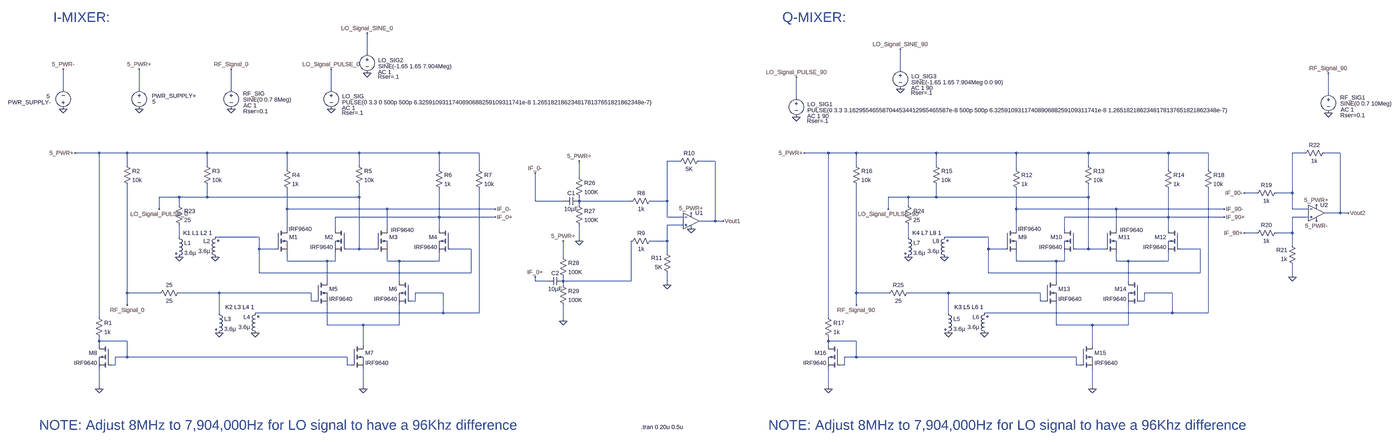
[diagram p0: schematic QUADRATURE MIXERS (MARCH 08,2025) biased outputs.asc, whole sheet]
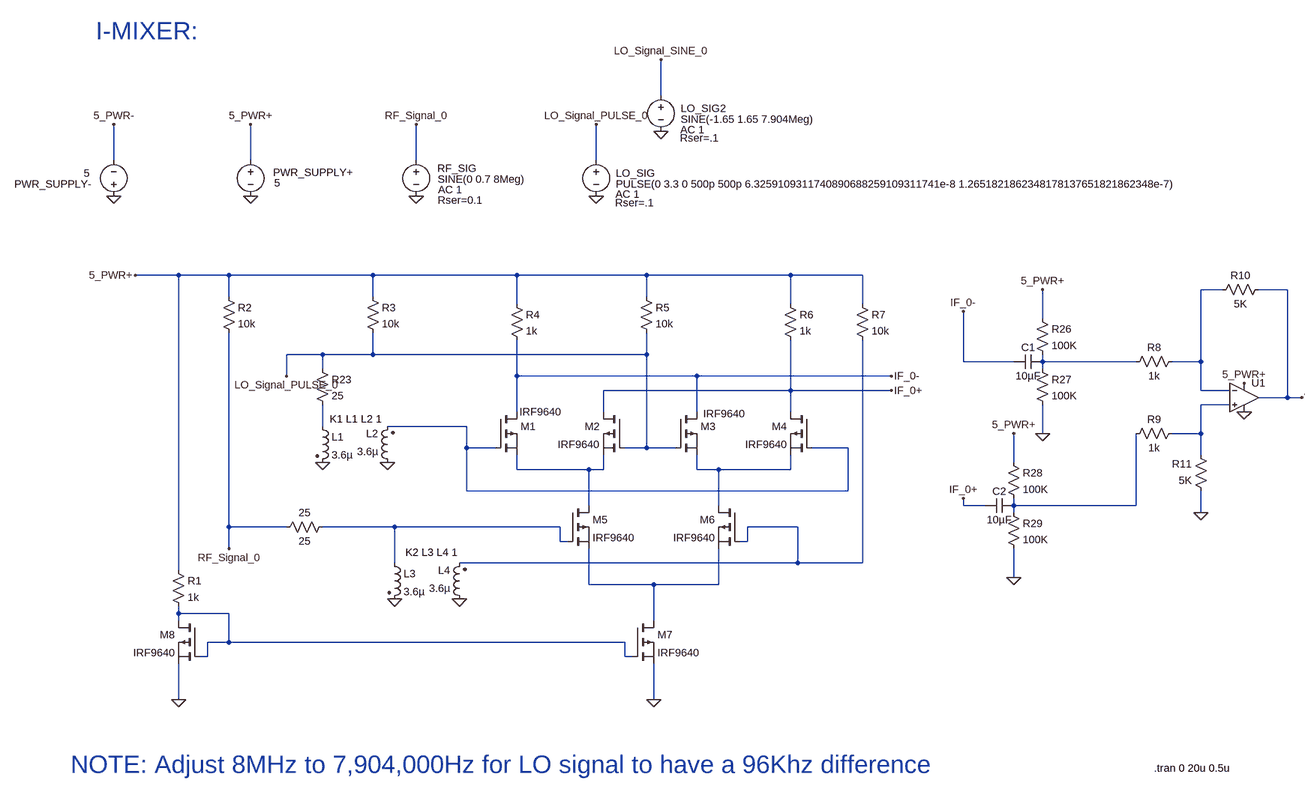
[diagram p1: schematic QUADRATURE MIXERS (MARCH 08,2025) biased outputs.asc, part, row 1 of 1, column 1 of 2]
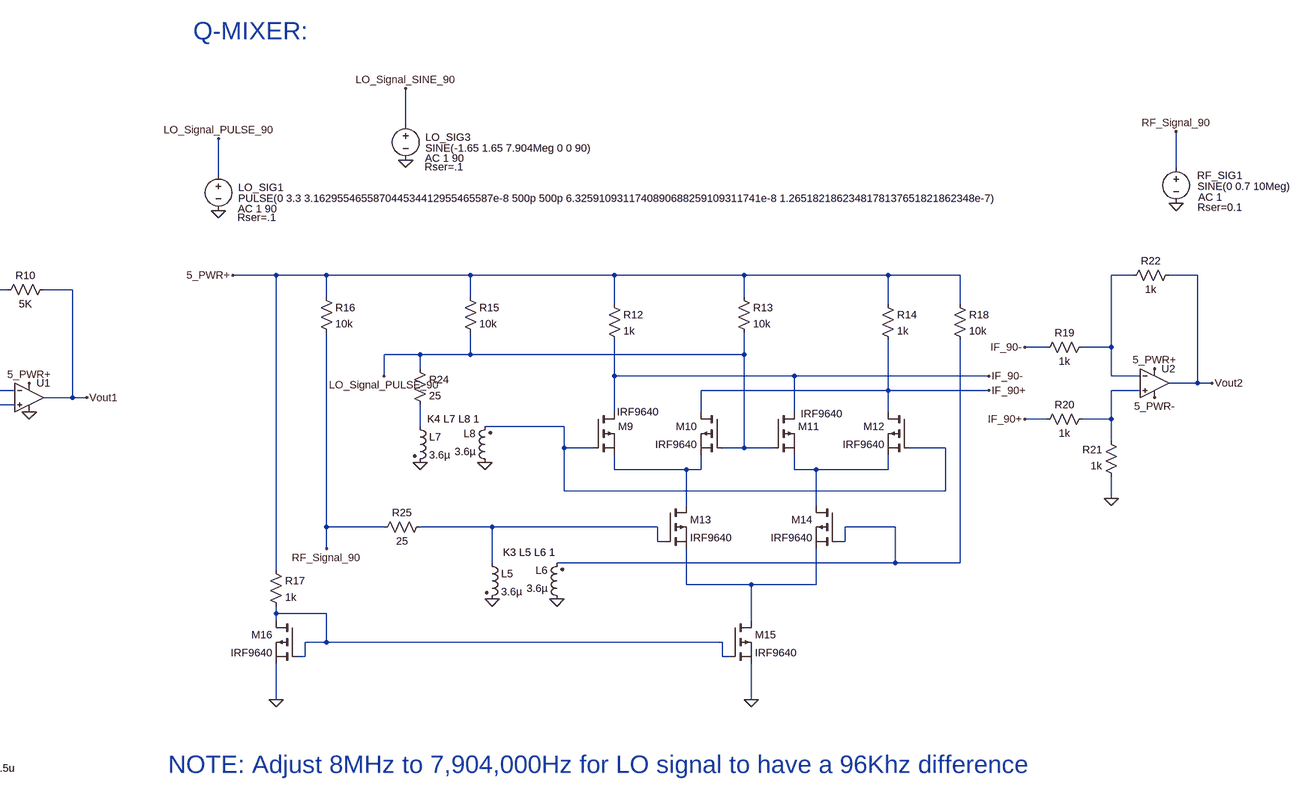
[diagram p2: schematic QUADRATURE MIXERS (MARCH 08,2025) biased outputs.asc, part, row 1 of 1, column 2 of 2]
QUADRATURE MIXERS (MARCH 08,2025) biased outputs.asc, the LTspice schematic file:
Version 4
SHEET 1 5048 2228
WIRE 352 464 352 384
WIRE 2528 528 2528 448
WIRE -864 608 -864 528
WIRE -560 608 -560 528
WIRE -192 608 -192 528
WIRE 208 608 208 528
WIRE 4240 624 4240 544
WIRE 2112 640 2112 560
WIRE -720 864 -816 864
WIRE -608 864 -720 864
WIRE -288 864 -608 864
WIRE 32 864 -288 864
WIRE 320 864 32 864
WIRE 640 864 320 864
WIRE 800 864 640 864
WIRE 2240 864 2144 864
WIRE 2352 864 2240 864
WIRE 2672 864 2352 864
WIRE 2992 864 2672 864
WIRE 3280 864 2992 864
WIRE 3600 864 3280 864
WIRE 3760 864 3600 864
WIRE 4144 864 4096 864
WIRE 4288 864 4224 864
WIRE 1600 896 1552 896
WIRE 1744 896 1680 896
WIRE -608 912 -608 864
WIRE -288 912 -288 864
WIRE 320 912 320 864
WIRE 2352 912 2352 864
WIRE 2672 912 2672 864
WIRE 3280 912 3280 864
WIRE 32 928 32 864
WIRE 640 928 640 864
WIRE 800 928 800 864
WIRE 2992 928 2992 864
WIRE 3600 928 3600 864
WIRE 3760 928 3760 864
WIRE 1200 960 1200 896
WIRE 3952 1024 3904 1024
WIRE 4096 1024 4096 864
WIRE 4096 1024 4032 1024
WIRE -400 1040 -480 1040
WIRE -288 1040 -288 992
WIRE -288 1040 -400 1040
WIRE 320 1040 320 992
WIRE 320 1040 -288 1040
WIRE 2560 1040 2480 1040
WIRE 2672 1040 2672 992
WIRE 2672 1040 2560 1040
WIRE 3280 1040 3280 992
WIRE 3280 1040 2672 1040
WIRE 1024 1056 1024 944
WIRE 1136 1056 1024 1056
WIRE 1200 1056 1200 1040
WIRE 1408 1056 1200 1056
WIRE 1552 1056 1552 896
WIRE 1552 1056 1488 1056
WIRE -400 1072 -400 1040
WIRE 1200 1072 1200 1056
WIRE 2560 1072 2560 1040
WIRE -480 1088 -480 1040
WIRE 32 1088 32 1008
WIRE 432 1088 32 1088
WIRE 864 1088 432 1088
WIRE 2480 1088 2480 1040
WIRE 2992 1088 2992 1008
WIRE 3392 1088 2992 1088
WIRE 3824 1088 3392 1088
WIRE 4096 1088 4096 1024
WIRE 4160 1088 4096 1088
WIRE 4288 1104 4288 864
WIRE 4288 1104 4224 1104
WIRE 4320 1104 4288 1104
WIRE 640 1120 640 1008
WIRE 640 1120 224 1120
WIRE 864 1120 640 1120
WIRE 1552 1120 1552 1056
WIRE 1616 1120 1552 1120
WIRE 3600 1120 3600 1008
WIRE 3600 1120 3184 1120
WIRE 3824 1120 3600 1120
WIRE 4160 1120 4096 1120
WIRE 1744 1136 1744 896
WIRE 1744 1136 1680 1136
WIRE 1776 1136 1744 1136
WIRE 1616 1152 1552 1152
WIRE 32 1168 32 1088
WIRE 224 1168 224 1120
WIRE 432 1168 432 1088
WIRE 640 1168 640 1120
WIRE 2992 1168 2992 1088
WIRE 3184 1168 3184 1120
WIRE 3392 1168 3392 1088
WIRE 3600 1168 3600 1120
WIRE 3952 1184 3904 1184
WIRE 4096 1184 4096 1120
WIRE 4096 1184 4032 1184
WIRE -400 1200 -400 1152
WIRE -80 1200 -256 1200
WIRE 2560 1200 2560 1152
WIRE 2880 1200 2704 1200
WIRE 1200 1216 1200 1152
WIRE 1552 1216 1552 1152
WIRE 1552 1216 1488 1216
WIRE 4096 1232 4096 1184
WIRE -80 1248 -80 1200
WIRE -16 1248 -80 1248
WIRE 320 1248 320 1040
WIRE 320 1248 272 1248
WIRE 384 1248 320 1248
WIRE 768 1248 688 1248
WIRE 2880 1248 2880 1200
WIRE 2944 1248 2880 1248
WIRE 3280 1248 3280 1040
WIRE 3280 1248 3232 1248
WIRE 3344 1248 3280 1248
WIRE 3728 1248 3648 1248
WIRE 1552 1264 1552 1216
WIRE 1136 1280 1136 1216
WIRE 32 1296 32 1264
WIRE 192 1296 32 1296
WIRE 224 1296 224 1264
WIRE 224 1296 192 1296
WIRE 432 1296 432 1264
WIRE 480 1296 432 1296
WIRE 640 1296 640 1264
WIRE 640 1296 480 1296
WIRE 2992 1296 2992 1264
WIRE 3152 1296 2992 1296
WIRE 3184 1296 3184 1264
WIRE 3184 1296 3152 1296
WIRE 3392 1296 3392 1264
WIRE 3440 1296 3392 1296
WIRE 3600 1296 3600 1264
WIRE 3600 1296 3440 1296
WIRE -80 1344 -80 1248
WIRE 768 1344 768 1248
WIRE 768 1344 -80 1344
WIRE 2880 1344 2880 1248
WIRE 3728 1344 3728 1248
WIRE 3728 1344 2880 1344
WIRE 4096 1360 4096 1312
WIRE 192 1376 192 1296
WIRE 480 1376 480 1296
WIRE 1024 1376 1024 1360
WIRE 1072 1376 1024 1376
WIRE 1136 1376 1136 1360
WIRE 1408 1376 1408 1216
WIRE 1408 1376 1136 1376
WIRE 3152 1376 3152 1296
WIRE 3440 1376 3440 1296
WIRE 1136 1392 1136 1376
WIRE 1552 1392 1552 1344
WIRE -608 1424 -608 992
WIRE -480 1424 -608 1424
WIRE -240 1424 -400 1424
WIRE 128 1424 -240 1424
WIRE 656 1424 544 1424
WIRE 2352 1424 2352 992
WIRE 2480 1424 2352 1424
WIRE 2720 1424 2560 1424
WIRE 3088 1424 2720 1424
WIRE 3616 1424 3504 1424
WIRE 128 1456 128 1424
WIRE 144 1456 128 1456
WIRE 544 1456 544 1424
WIRE 544 1456 528 1456
WIRE 3088 1456 3088 1424
WIRE 3104 1456 3088 1456
WIRE 3504 1456 3504 1424
WIRE 3504 1456 3488 1456
WIRE -608 1472 -608 1424
WIRE 2352 1472 2352 1424
WIRE -240 1504 -240 1424
WIRE 656 1504 656 1424
WIRE 656 1504 -96 1504
WIRE 800 1504 800 1008
WIRE 800 1504 656 1504
WIRE 2720 1504 2720 1424
WIRE 3616 1504 3616 1424
WIRE 3616 1504 2864 1504
WIRE 3760 1504 3760 1008
WIRE 3760 1504 3616 1504
WIRE -720 1520 -720 864
WIRE 2240 1520 2240 864
WIRE 1136 1536 1136 1472
WIRE 192 1552 192 1472
WIRE 336 1552 192 1552
WIRE 480 1552 480 1472
WIRE 480 1552 336 1552
WIRE 3152 1552 3152 1472
WIRE 3296 1552 3152 1552
WIRE 3440 1552 3440 1472
WIRE 3440 1552 3296 1552
WIRE -720 1616 -720 1600
WIRE -608 1616 -720 1616
WIRE 2240 1616 2240 1600
WIRE 2352 1616 2240 1616
WIRE -720 1632 -720 1616
WIRE 336 1632 336 1552
WIRE 2240 1632 2240 1616
WIRE 3296 1632 3296 1552
WIRE -608 1680 -608 1616
WIRE -608 1680 -656 1680
WIRE 272 1680 -608 1680
WIRE 2352 1680 2352 1616
WIRE 2352 1680 2304 1680
WIRE 3232 1680 2352 1680
WIRE -656 1712 -656 1680
WIRE -656 1712 -672 1712
WIRE 272 1712 272 1680
WIRE 288 1712 272 1712
WIRE 2304 1712 2304 1680
WIRE 2304 1712 2288 1712
WIRE 3232 1712 3232 1680
WIRE 3248 1712 3232 1712
WIRE -720 1808 -720 1728
WIRE 336 1808 336 1728
WIRE 2240 1808 2240 1728
WIRE 3296 1808 3296 1728
FLAG 336 1808 0
FLAG 864 1088 IF_0-
FLAG 864 1120 IF_0+
FLAG -560 688 0
FLAG -720 1808 0
FLAG -192 688 0
FLAG -240 1584 0
FLAG -96 1584 0
FLAG -400 1280 0
FLAG -256 1280 0
FLAG 208 688 0
FLAG -560 528 5_PWR+
FLAG -816 864 5_PWR+
FLAG -608 1472 RF_Signal_0
FLAG -192 528 RF_Signal_0
FLAG 208 528 LO_Signal_PULSE_0
FLAG -480 1088 LO_Signal_PULSE_0
FLAG 1552 1392 0
FLAG 1024 1360 IF_0+
FLAG 1024 944 IF_0-
FLAG 1776 1136 Vout1
FLAG -864 688 0
FLAG -864 528 5_PWR-
FLAG 1648 1104 5_PWR+
FLAG 3296 1808 0
FLAG 3824 1088 IF_90-
FLAG 3824 1120 IF_90+
FLAG 2240 1808 0
FLAG 2720 1584 0
FLAG 2864 1584 0
FLAG 2560 1280 0
FLAG 2704 1280 0
FLAG 2112 720 0
FLAG 2144 864 5_PWR+
FLAG 2352 1472 RF_Signal_90
FLAG 2112 560 LO_Signal_PULSE_90
FLAG 2480 1088 LO_Signal_PULSE_90
FLAG 4096 1360 0
FLAG 3904 1184 IF_90+
FLAG 3904 1024 IF_90-
FLAG 4320 1104 Vout2
FLAG 4192 1136 5_PWR-
FLAG 4192 1072 5_PWR+
FLAG 4240 704 0
FLAG 4240 544 RF_Signal_90
FLAG 352 544 0
FLAG 352 384 LO_Signal_SINE_0
FLAG 2528 608 0
FLAG 2528 448 LO_Signal_SINE_90
FLAG 1200 1216 0
FLAG 1200 896 5_PWR+
FLAG 1136 1536 0
FLAG 1136 1216 5_PWR+
FLAG 1648 1168 0
SYMBOL res 16 912 R0
SYMATTR InstName R4
SYMATTR Value 1k
SYMBOL res 304 896 R0
SYMATTR InstName R5
SYMATTR Value 10k
SYMBOL res 624 912 R0
SYMATTR InstName R6
SYMATTR Value 1k
SYMBOL res -304 896 R0
SYMATTR InstName R3
SYMATTR Value 10k
SYMBOL res -624 896 R0
SYMATTR InstName R2
SYMATTR Value 10k
SYMBOL res -736 1504 R0
SYMATTR InstName R1
SYMATTR Value 1k
SYMBOL voltage -560 592 R0
WINDOW 0 50 43 Left 2
WINDOW 3 53 67 Left 2
WINDOW 123 0 0 Left 0
WINDOW 39 0 0 Left 0
SYMATTR InstName PWR_SUPPLY+
SYMATTR Value 5
SYMBOL voltage -192 592 R0
WINDOW 0 47 34 Left 2
WINDOW 3 48 58 Left 2
WINDOW 123 49 82 Left 2
WINDOW 39 48 105 Left 2
SYMATTR InstName RF_SIG
SYMATTR Value SINE(0 0.7 8Meg)
SYMATTR Value2 AC 1
SYMATTR SpiceLine Rser=0.1
SYMBOL res 784 912 R0
SYMATTR InstName R7
SYMATTR Value 10k
SYMBOL ind2 -256 1488 R0
SYMATTR InstName L3
SYMATTR Value 3.6µ
SYMATTR Type ind
SYMBOL ind2 -80 1600 R180
WINDOW 0 36 80 Left 2
WINDOW 3 36 40 Left 2
SYMATTR InstName L4
SYMATTR Value 3.6µ
SYMATTR Type ind
SYMBOL ind2 -416 1184 R0
SYMATTR InstName L1
SYMATTR Value 3.6µ
SYMATTR Type ind
SYMBOL ind2 -240 1296 R180
WINDOW 0 36 80 Left 2
WINDOW 3 36 40 Left 2
SYMATTR InstName L2
SYMATTR Value 3.6µ
SYMATTR Type ind
SYMBOL pmos -16 1168 R0
WINDOW 3 54 0 Left 2
SYMATTR Value IRF9640
SYMATTR InstName M1
SYMBOL pmos 272 1168 M0
SYMATTR InstName M2
SYMATTR Value IRF9640
SYMBOL pmos 384 1168 R0
WINDOW 3 62 4 Left 2
SYMATTR Value IRF9640
SYMATTR InstName M3
SYMBOL pmos 688 1168 M0
SYMATTR InstName M4
SYMATTR Value IRF9640
SYMBOL pmos 144 1376 R0
SYMATTR InstName M5
SYMATTR Value IRF9640
SYMBOL pmos 528 1376 M0
SYMATTR InstName M6
SYMATTR Value IRF9640
SYMBOL pmos 288 1632 R0
SYMATTR InstName M7
SYMATTR Value IRF9640
SYMBOL pmos -672 1632 M0
SYMATTR InstName M8
SYMATTR Value IRF9640
SYMBOL voltage 208 592 R0
WINDOW 0 44 45 Left 2
WINDOW 3 44 69 Left 2
WINDOW 123 43 92 Left 2
WINDOW 39 42 111 Left 2
SYMATTR InstName LO_SIG
SYMATTR Value PULSE(0 3.3 0 500p 500p 6.3259109311740890688259109311741e-8 1.2651821862348178137651821862348e-7)
SYMATTR Value2 AC 1
SYMATTR SpiceLine Rser=.1
SYMBOL UniversalOpAmp 1648 1136 R0
SYMATTR InstName U1
SYMATTR Value2 Avol=110Meg GBW=50Meg Vos=0
SYMBOL res 1504 1040 R90
WINDOW 0 0 56 VBottom 2
WINDOW 3 32 56 VTop 2
SYMATTR InstName R8
SYMATTR Value 1k
SYMBOL res 1504 1200 R90
WINDOW 0 0 56 VBottom 2
WINDOW 3 32 56 VTop 2
SYMATTR InstName R9
SYMATTR Value 1k
SYMBOL res 1568 1360 R180
WINDOW 0 36 76 Left 2
WINDOW 3 36 40 Left 2
SYMATTR InstName R11
SYMATTR Value 5K
SYMBOL res 1584 912 R270
WINDOW 0 32 56 VTop 2
WINDOW 3 0 56 VBottom 2
SYMATTR InstName R10
SYMATTR Value 5K
SYMBOL voltage -864 704 R180
WINDOW 0 50 43 Left 2
WINDOW 3 53 67 Left 2
WINDOW 123 0 0 Left 0
WINDOW 39 0 0 Left 0
SYMATTR InstName PWR_SUPPLY-
SYMATTR Value 5
SYMBOL res 2976 912 R0
SYMATTR InstName R12
SYMATTR Value 1k
SYMBOL res 3264 896 R0
SYMATTR InstName R13
SYMATTR Value 10k
SYMBOL res 3584 912 R0
SYMATTR InstName R14
SYMATTR Value 1k
SYMBOL res 2656 896 R0
SYMATTR InstName R15
SYMATTR Value 10k
SYMBOL res 2336 896 R0
SYMATTR InstName R16
SYMATTR Value 10k
SYMBOL res 2224 1504 R0
SYMATTR InstName R17
SYMATTR Value 1k
SYMBOL res 3744 912 R0
SYMATTR InstName R18
SYMATTR Value 10k
SYMBOL ind2 2704 1488 R0
SYMATTR InstName L5
SYMATTR Value 3.6µ
SYMATTR Type ind
SYMBOL ind2 2880 1600 R180
WINDOW 0 36 80 Left 2
WINDOW 3 36 40 Left 2
SYMATTR InstName L6
SYMATTR Value 3.6µ
SYMATTR Type ind
SYMBOL ind2 2544 1184 R0
SYMATTR InstName L7
SYMATTR Value 3.6µ
SYMATTR Type ind
SYMBOL ind2 2720 1296 R180
WINDOW 0 36 80 Left 2
WINDOW 3 36 40 Left 2
SYMATTR InstName L8
SYMATTR Value 3.6µ
SYMATTR Type ind
SYMBOL pmos 2944 1168 R0
WINDOW 3 54 0 Left 2
SYMATTR Value IRF9640
SYMATTR InstName M9
SYMBOL pmos 3232 1168 M0
SYMATTR InstName M10
SYMATTR Value IRF9640
SYMBOL pmos 3344 1168 R0
WINDOW 3 62 4 Left 2
SYMATTR Value IRF9640
SYMATTR InstName M11
SYMBOL pmos 3648 1168 M0
SYMATTR InstName M12
SYMATTR Value IRF9640
SYMBOL pmos 3104 1376 R0
SYMATTR InstName M13
SYMATTR Value IRF9640
SYMBOL pmos 3488 1376 M0
SYMATTR InstName M14
SYMATTR Value IRF9640
SYMBOL pmos 3248 1632 R0
SYMATTR InstName M15
SYMATTR Value IRF9640
SYMBOL pmos 2288 1632 M0
SYMATTR InstName M16
SYMATTR Value IRF9640
SYMBOL voltage 2112 624 R0
WINDOW 0 44 45 Left 2
WINDOW 3 44 69 Left 2
WINDOW 123 43 92 Left 2
WINDOW 39 42 111 Left 2
SYMATTR InstName LO_SIG1
SYMATTR Value PULSE(0 3.3 3.162955465587044534412955465587e-8 500p 500p 6.3259109311740890688259109311741e-8 1.2651821862348178137651821862348e-7)
SYMATTR Value2 AC 1 90
SYMATTR SpiceLine Rser=.1
SYMBOL UniversalOpAmp 4192 1104 R0
SYMATTR InstName U2
SYMBOL res 4048 1008 R90
WINDOW 0 0 56 VBottom 2
WINDOW 3 32 56 VTop 2
SYMATTR InstName R19
SYMATTR Value 1k
SYMBOL res 4048 1168 R90
WINDOW 0 0 56 VBottom 2
WINDOW 3 32 56 VTop 2
SYMATTR InstName R20
SYMATTR Value 1k
SYMBOL res 4112 1328 R180
WINDOW 0 36 76 Left 2
WINDOW 3 36 40 Left 2
SYMATTR InstName R21
SYMATTR Value 1k
SYMBOL res 4128 880 R270
WINDOW 0 32 56 VTop 2
WINDOW 3 0 56 VBottom 2
SYMATTR InstName R22
SYMATTR Value 1k
SYMBOL voltage 4240 608 R0
WINDOW 0 47 34 Left 2
WINDOW 3 48 58 Left 2
WINDOW 123 49 82 Left 2
WINDOW 39 48 105 Left 2
SYMATTR InstName RF_SIG1
SYMATTR Value SINE(0 0.7 10Meg)
SYMATTR Value2 AC 1
SYMATTR SpiceLine Rser=0.1
SYMBOL res -416 1056 R0
SYMATTR InstName R23
SYMATTR Value 25
SYMBOL res -384 1408 R90
WINDOW 0 0 56 VBottom 2
WINDOW 3 32 56 VTop 2
SYMATTR InstName 25
SYMATTR Value 25
SYMBOL voltage 352 448 R0
WINDOW 0 44 45 Left 2
WINDOW 3 44 69 Left 2
WINDOW 123 43 92 Left 2
WINDOW 39 42 111 Left 2
SYMATTR InstName LO_SIG2
SYMATTR Value SINE(-1.65 1.65 7.904Meg)
SYMATTR Value2 AC 1
SYMATTR SpiceLine Rser=.1
SYMBOL voltage 2528 512 R0
WINDOW 0 44 45 Left 2
WINDOW 3 44 69 Left 2
WINDOW 123 43 92 Left 2
WINDOW 39 42 111 Left 2
SYMATTR InstName LO_SIG3
SYMATTR Value SINE(-1.65 1.65 7.904Meg 0 0 90)
SYMATTR Value2 AC 1 90
SYMATTR SpiceLine Rser=.1
SYMBOL res 2544 1056 R0
SYMATTR InstName R24
SYMATTR Value 25
SYMBOL res 2576 1408 R90
WINDOW 0 0 56 VBottom 2
WINDOW 3 32 56 VTop 2
SYMATTR InstName R25
SYMATTR Value 25
SYMBOL Res 1184 944 R0
SYMATTR InstName R26
SYMATTR Value 100K
SYMBOL Res 1184 1056 R0
SYMATTR InstName R27
SYMATTR Value 100K
SYMBOL Res 1120 1264 R0
SYMATTR InstName R28
SYMATTR Value 100K
SYMBOL Res 1120 1376 R0
SYMATTR InstName R29
SYMATTR Value 100K
SYMBOL Cap 1200 1040 R90
WINDOW 0 0 32 VBottom 2
WINDOW 3 32 32 VTop 2
SYMATTR InstName C1
SYMATTR Value 10µF
SYMBOL Cap 1136 1360 R90
WINDOW 0 0 32 VBottom 2
WINDOW 3 32 32 VTop 2
SYMATTR InstName C2
SYMATTR Value 10µF
TEXT 1448 1960 Left 2 !.tran 0 20u 0.5u
TEXT -216 1480 Left 2 !K2 L3 L4 1
TEXT -384 1184 Left 2 !K1 L1 L2 1
TEXT -960 1952 Left 5 ;NOTE: Adjust 8MHz to 7,904,000Hz for LO signal to have a 96Khz difference
TEXT -904 320 Left 5 ;I-MIXER:
TEXT 2744 1480 Left 2 !K3 L5 L6 1
TEXT 2576 1184 Left 2 !K4 L7 L8 1
TEXT 2000 1952 Left 5 ;NOTE: Adjust 8MHz to 7,904,000Hz for LO signal to have a 96Khz difference
TEXT 2056 320 Left 5 ;Q-MIXER:

The netlist it stands for:
* QUADRATURE MIXERS (MARCH 08,2025) biased outputs.asc
R4 5_PWR+ IF_0- 1k
R5 5_PWR+ LO_Signal_PULSE_0 10k
R6 5_PWR+ IF_0+ 1k
R3 5_PWR+ LO_Signal_PULSE_0 10k
R2 5_PWR+ RF_Signal_0 10k
R1 5_PWR+ N021 1k
V§PWR_SUPPLY+ 5_PWR+ 0 5
V§RF_SIG RF_Signal_0 0 SINE(0 0.7 8Meg) AC 1 Rser=0.1
R7 5_PWR+ N016 10k
L3 N015 0 3.6µ
L4 0 N016 3.6µ
L1 N006 0 3.6µ
L2 0 N007 3.6µ
M1 IF_0- N007 N010 N010 IRF9640
M2 IF_0+ LO_Signal_PULSE_0 N010 N010 IRF9640
M3 IF_0- LO_Signal_PULSE_0 N011 N011 IRF9640
M4 IF_0+ N007 N011 N011 IRF9640
M5 N010 N015 N019 N019 IRF9640
M6 N011 N016 N019 N019 IRF9640
M7 N019 N021 0 0 IRF9640
M8 N021 N021 0 0 IRF9640
V§LO_SIG LO_Signal_PULSE_0 0 PULSE(0 3.3 0 500p 500p 6.3259109311740890688259109311741e-8 1.2651821862348178137651821862348e-7) AC 1 Rser=.1
XU1 N005 N002 5_PWR+ 0 Vout1 level1 Avol=110Meg GBW=50Meg Vos=0 En=0 Enk=0 In=0 Ink=0 Rin=500Meg  ; pins In+ In- V+ V- OUT
R8 N002 N003 1k
R9 N005 N014 1k
R11 0 N005 5K
R10 N002 Vout1 5K
V§PWR_SUPPLY- 0 5_PWR- 5
R12 5_PWR+ IF_90- 1k
R13 5_PWR+ LO_Signal_PULSE_90 10k
R14 5_PWR+ IF_90+ 1k
R15 5_PWR+ LO_Signal_PULSE_90 10k
R16 5_PWR+ RF_Signal_90 10k
R17 5_PWR+ N022 1k
R18 5_PWR+ N018 10k
L5 N017 0 3.6µ
L6 0 N018 3.6µ
L7 N008 0 3.6µ
L8 0 N009 3.6µ
M9 IF_90- N009 N012 N012 IRF9640
M10 IF_90+ LO_Signal_PULSE_90 N012 N012 IRF9640
M11 IF_90- LO_Signal_PULSE_90 N013 N013 IRF9640
M12 IF_90+ N009 N013 N013 IRF9640
M13 N012 N017 N020 N020 IRF9640
M14 N013 N018 N020 N020 IRF9640
M15 N020 N022 0 0 IRF9640
M16 N022 N022 0 0 IRF9640
V§LO_SIG1 LO_Signal_PULSE_90 0 PULSE(0 3.3 3.162955465587044534412955465587e-8 500p 500p 6.3259109311740890688259109311741e-8 1.2651821862348178137651821862348e-7) AC 1 90 Rser=.1
XU2 N004 N001 5_PWR+ 5_PWR- Vout2 level1 Avol=1Meg GBW=10Meg Vos=0 En=0 Enk=0 In=0 Ink=0 Rin=500Meg  ; pins In+ In- V+ V- OUT
R19 N001 IF_90- 1k
R20 N004 IF_90+ 1k
R21 0 N004 1k
R22 N001 Vout2 1k
V§RF_SIG1 RF_Signal_90 0 SINE(0 0.7 10Meg) AC 1 Rser=0.1
R23 LO_Signal_PULSE_0 N006 25
R§25 N015 RF_Signal_0 25
V§LO_SIG2 LO_Signal_SINE_0 0 SINE(-1.65 1.65 7.904Meg) AC 1 Rser=.1
V§LO_SIG3 LO_Signal_SINE_90 0 SINE(-1.65 1.65 7.904Meg 0 0 90) AC 1 90 Rser=.1
R24 LO_Signal_PULSE_90 N008 25
R25 N017 RF_Signal_90 25
R26 5_PWR+ N003 100K
R27 N003 0 100K
R28 5_PWR+ N014 100K
R29 N014 0 100K
C1 N003 IF_0- 10µF
C2 N014 IF_0+ 10µF
.model NMOS NMOS
.model PMOS PMOS
.lib standard.mos
.tran 0 20u 0.5u
K2 L3 L4 1
K1 L1 L2 1
* NOTE: Adjust 8MHz to 7,904,000Hz for LO signal to have a 96Khz difference
* I-MIXER:
K3 L5 L6 1
K4 L7 L8 1
* NOTE: Adjust 8MHz to 7,904,000Hz for LO signal to have a 96Khz difference
* Q-MIXER:
.lib UniversalOpAmp1.lib
.backanno
.end